# Altium project PC104Breakout.PrjPcb
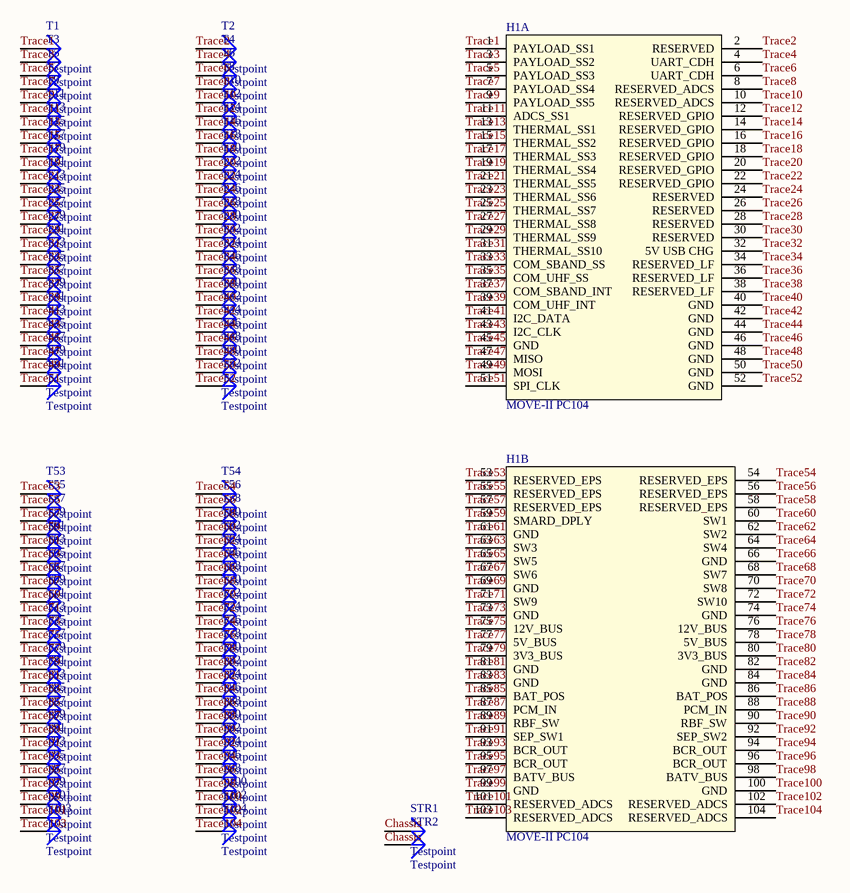
[diagram p0: PC104Breakout.SchDoc]
1 sheet, 107 parts. Net scope: global (net labels, ports and power ports of the same name join across sheets).
Board file: PC104Breakout.PcbDoc

## Sheet PC104Breakout.SchDoc
size A4

### Parts
H1  MOVE-II PC104  [PC104]  (parts A,B of 2)
STR1  Testpoint  [PIN1]
STR2  Testpoint  [PIN1]
T1  Testpoint  [PIN1]
T2  Testpoint  [PIN1]
T3  Testpoint  [PIN1]
T4  Testpoint  [PIN1]
T5  Testpoint  [PIN1]
T6  Testpoint  [PIN1]
T7  Testpoint  [PIN1]
T8  Testpoint  [PIN1]
T9  Testpoint  [PIN1]
T10  Testpoint  [PIN1]
T11  Testpoint  [PIN1]
T12  Testpoint  [PIN1]
T13  Testpoint  [PIN1]
T14  Testpoint  [PIN1]
T15  Testpoint  [PIN1]
T16  Testpoint  [PIN1]
T17  Testpoint  [PIN1]
T18  Testpoint  [PIN1]
T19  Testpoint  [PIN1]
T20  Testpoint  [PIN1]
T21  Testpoint  [PIN1]
T22  Testpoint  [PIN1]
T23  Testpoint  [PIN1]
T24  Testpoint  [PIN1]
T25  Testpoint  [PIN1]
T26  Testpoint  [PIN1]
T27  Testpoint  [PIN1]
T28  Testpoint  [PIN1]
T29  Testpoint  [PIN1]
T30  Testpoint  [PIN1]
T31  Testpoint  [PIN1]
T32  Testpoint  [PIN1]
T33  Testpoint  [PIN1]
T34  Testpoint  [PIN1]
T35  Testpoint  [PIN1]
T36  Testpoint  [PIN1]
T37  Testpoint  [PIN1]
T38  Testpoint  [PIN1]
T39  Testpoint  [PIN1]
T40  Testpoint  [PIN1]
T41  Testpoint  [PIN1]
T42  Testpoint  [PIN1]
T43  Testpoint  [PIN1]
T44  Testpoint  [PIN1]
T45  Testpoint  [PIN1]
T46  Testpoint  [PIN1]
T47  Testpoint  [PIN1]
T48  Testpoint  [PIN1]
T49  Testpoint  [PIN1]
T50  Testpoint  [PIN1]
T51  Testpoint  [PIN1]
T52  Testpoint  [PIN1]
T53  Testpoint  [PIN1]
T54  Testpoint  [PIN1]
T55  Testpoint  [PIN1]
T56  Testpoint  [PIN1]
T57  Testpoint  [PIN1]
T58  Testpoint  [PIN1]
T59  Testpoint  [PIN1]
T60  Testpoint  [PIN1]
T61  Testpoint  [PIN1]
T62  Testpoint  [PIN1]
T63  Testpoint  [PIN1]
T64  Testpoint  [PIN1]
T65  Testpoint  [PIN1]
T66  Testpoint  [PIN1]
T67  Testpoint  [PIN1]
T68  Testpoint  [PIN1]
T69  Testpoint  [PIN1]
T70  Testpoint  [PIN1]
T71  Testpoint  [PIN1]
T72  Testpoint  [PIN1]
T73  Testpoint  [PIN1]
T74  Testpoint  [PIN1]
T75  Testpoint  [PIN1]
T76  Testpoint  [PIN1]
T77  Testpoint  [PIN1]
T78  Testpoint  [PIN1]
T79  Testpoint  [PIN1]
T80  Testpoint  [PIN1]
T81  Testpoint  [PIN1]
T82  Testpoint  [PIN1]
T83  Testpoint  [PIN1]
T84  Testpoint  [PIN1]
T85  Testpoint  [PIN1]
T86  Testpoint  [PIN1]
T87  Testpoint  [PIN1]
T88  Testpoint  [PIN1]
T89  Testpoint  [PIN1]
T90  Testpoint  [PIN1]
T91  Testpoint  [PIN1]
T92  Testpoint  [PIN1]
T93  Testpoint  [PIN1]
T94  Testpoint  [PIN1]
T95  Testpoint  [PIN1]
T96  Testpoint  [PIN1]
T97  Testpoint  [PIN1]
T98  Testpoint  [PIN1]
T99  Testpoint  [PIN1]
T100  Testpoint  [PIN1]
T101  Testpoint  [PIN1]
T102  Testpoint  [PIN1]
T103  Testpoint  [PIN1]
T104  Testpoint  [PIN1]

### Nets
Chassis: STR1.1 STR2.1
Trace1: H1.1(PAYLOAD_SS1) T1.1
Trace2: H1.2(RESERVED) T2.1
Trace3: H1.3(PAYLOAD_SS2) T3.1
Trace4: H1.4(UART_CDH) T4.1
Trace5: H1.5(PAYLOAD_SS3) T5.1
Trace6: H1.6(UART_CDH) T6.1
Trace7: H1.7(PAYLOAD_SS4) T7.1
Trace8: H1.8(RESERVED_ADCS) T8.1
Trace9: H1.9(PAYLOAD_SS5) T9.1
Trace10: H1.10(RESERVED_ADCS) T10.1
Trace11: H1.11(ADCS_SS1) T11.1
Trace12: H1.12(RESERVED_GPIO) T12.1
Trace13: H1.13(THERMAL_SS1) T13.1
Trace14: H1.14(RESERVED_GPIO) T14.1
Trace15: H1.15(THERMAL_SS2) T15.1
Trace16: H1.16(RESERVED_GPIO) T16.1
Trace17: H1.17(THERMAL_SS3) T17.1
Trace18: H1.18(RESERVED_GPIO) T18.1
Trace19: H1.19(THERMAL_SS4) T19.1
Trace20: H1.20(RESERVED_GPIO) T20.1
Trace21: H1.21(THERMAL_SS5) T21.1
Trace22: H1.22(RESERVED_GPIO) T22.1
Trace23: H1.23(THERMAL_SS6) T23.1
Trace24: H1.24(RESERVED) T24.1
Trace25: H1.25(THERMAL_SS7) T25.1
Trace26: H1.26(RESERVED) T26.1
Trace27: H1.27(THERMAL_SS8) T27.1
Trace28: H1.28(RESERVED) T28.1
Trace29: H1.29(THERMAL_SS9) T29.1
Trace30: H1.30(RESERVED) T30.1
Trace31: H1.31(THERMAL_SS10) T31.1
Trace32: H1.32(5V_USB_CHG) T32.1
Trace33: H1.33(COM_SBAND_SS) T33.1
Trace34: H1.34(RESERVED_LF) T34.1
Trace35: H1.35(COM_UHF_SS) T35.1
Trace36: H1.36(RESERVED_LF) T36.1
Trace37: H1.37(COM_SBAND_INT) T37.1
Trace38: H1.38(RESERVED_LF) T38.1
Trace39: H1.39(COM_UHF_INT) T39.1
Trace40: H1.40(GND) T40.1
Trace41: H1.41(I2C_DATA) T41.1
Trace42: H1.42(GND) T42.1
Trace43: H1.43(I2C_CLK) T43.1
Trace44: H1.44(GND) T44.1
Trace45: H1.45(GND) T45.1
Trace46: H1.46(GND) T46.1
Trace47: H1.47(MISO) T47.1
Trace48: H1.48(GND) T48.1
Trace49: H1.49(MOSI) T49.1
Trace50: H1.50(GND) T50.1
Trace51: H1.51(SPI_CLK) T51.1
Trace52: H1.52(GND) T52.1
Trace53: H1.53(RESERVED_EPS) T53.1
Trace54: H1.54(RESERVED_EPS) T54.1
Trace55: H1.55(RESERVED_EPS) T55.1
Trace56: H1.56(RESERVED_EPS) T56.1
Trace57: H1.57(RESERVED_EPS) T57.1
Trace58: H1.58(RESERVED_EPS) T58.1
Trace59: H1.59(SMARD_DPLY) T59.1
Trace60: H1.60(SW1) T60.1
Trace61: H1.61(GND) T61.1
Trace62: H1.62(SW2) T62.1
Trace63: H1.63(SW3) T63.1
Trace64: H1.64(SW4) T64.1
Trace65: H1.65(SW5) T65.1
Trace66: H1.66(GND) T66.1
Trace67: H1.67(SW6) T67.1
Trace68: H1.68(SW7) T68.1
Trace69: H1.69(GND) T69.1
Trace70: H1.70(SW8) T70.1
Trace71: H1.71(SW9) T71.1
Trace72: H1.72(SW10) T72.1
Trace73: H1.73(GND) T73.1
Trace74: H1.74(GND) T74.1
Trace75: H1.75(12V_BUS) T75.1
Trace76: H1.76(12V_BUS) T76.1
Trace77: H1.77(5V_BUS) T77.1
Trace78: H1.78(5V_BUS) T78.1
Trace79: H1.79(3V3_BUS) T79.1
Trace80: H1.80(3V3_BUS) T80.1
Trace81: H1.81(GND) T81.1
Trace82: H1.82(GND) T82.1
Trace83: H1.83(GND) T83.1
Trace84: H1.84(GND) T84.1
Trace85: H1.85(BAT_POS) T85.1
Trace86: H1.86(BAT_POS) T86.1
Trace87: H1.87(PCM_IN) T87.1
Trace88: H1.88(PCM_IN) T88.1
Trace89: H1.89(RBF_SW) T89.1
Trace90: H1.90(RBF_SW) T90.1
Trace91: H1.91(SEP_SW1) T91.1
Trace92: H1.92(SEP_SW2) T92.1
Trace93: H1.93(BCR_OUT) T93.1
Trace94: H1.94(BCR_OUT) T94.1
Trace95: H1.95(BCR_OUT) T95.1
Trace96: H1.96(BCR_OUT) T96.1
Trace97: H1.97(BATV_BUS) T97.1
Trace98: H1.98(BATV_BUS) T98.1
Trace99: H1.99(GND) T99.1
Trace100: H1.100(GND) T100.1
Trace101: H1.101(RESERVED_ADCS) T101.1
Trace102: H1.102(RESERVED_ADCS) T102.1
Trace103: H1.103(RESERVED_ADCS) T103.1
Trace104: H1.104(RESERVED_ADCS) T104.1

### Library data of the parts
STR1 STR2 T1-T104 = Plug: LatestRevisionDate: 17-Jul-2002; LatestRevisionNote: Re-released for DXP Platform.; Publisher: Altium Limited